# Altium schematic sheet MixerBF998.SchDoc
size A4
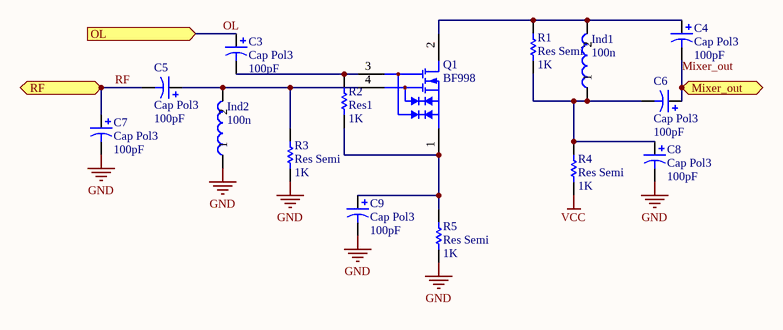
[diagram p0: MixerBF998.SchDoc]

## Parts
C3  Cap Pol3  value 100pF  [C0805]
C4  Cap Pol3  value 100pF  [C0805]
C5  Cap Pol3  value 100pF  [C0805]
C6  Cap Pol3  value 100pF  [C0805]
C7  Cap Pol3  value 100pF  [C0805]
C8  Cap Pol3  value 100pF  [C0805]
C9  Cap Pol3  value 100pF  [C0805]
Ind1  Valor: 100n  [IND_7MM]  (hidden comment: Ind2)
Ind2  Valor: 100n  [Ind_4mm]  (hidden comment: Ind2)
Q1  BF998  [SOT143_N]
R1  Res Semi  value 1K  [2012[0805]]
R2  Res1  value 1K  [AXIAL-0.3]
R3  Res Semi  value 1K  [2012[0805]]
R4  Res Semi  value 1K  [2012[0805]]
R5  Res Semi  value 1K  [2012[0805]]

## Ports
Mixer_out (out), OL (in), RF (in)

## Nets
GND: C7.2 C8.2 C9.2 Ind2.1 R3.1 R5.1
VCC: R4.1
Mixer_out: C4.2 C6.1 ; port Mixer_out
OL: C3.1 ; port OL
RF: C5.2 C7.1 ; port RF
NetC3_2: C3.2 Q1.3(G2) R2.2
NetC4_1: C4.1 Ind1.2 Q1.2(D) R1.2
NetC5_1: C5.1 Ind2.2 Q1.4(G1) R3.2
NetC6_2: C6.2 C8.1 Ind1.1 R1.1 R4.2
NetC9_1: C9.1 Q1.1(S) R2.1 R5.2

## Library data of the parts
C3-C9 = Cap Pol3: Polarized Capacitor (Surface Mount); Published: 8-Jun-2000; LatestRevisionDate: 17-Jul-2002; LatestRevisionNote: Re-released for DXP Platform.; PackageReference: C0805; Publisher: Altium Limited
Q1 = BF998: Silicon N-channel Dual-gate MOSFET; Published: 17-Sep-2003; LatestRevisionDate: 12-Dec-2006; LatestRevisionNote: IPC-7351 Footprint Added.; DatasheetVersion: Aug-1996; PackageVersion: Sep-1996; PackageReference: SOT143; Publisher: Altium Limited; PackageDescription: 4-Pin SOT-143 Package 1.9 mm Pitch, 2.3 mm Lead Span; Code_IPC: SOT143; ComponentLink1Description: Manufacturer Link; ComponentLink1URL: http://www.semiconductors.philips.com/; ComponentLink2Description: Datasheet; ComponentLink2URL: http://www.semiconductors.philips.com/acrobat/datasheets/BF998_2.pdf
R1 R3-R5 = Res Semi: Semiconductor Resistor; Published: 8-Jun-2000; LatestRevisionDate: 17-Jul-2002; LatestRevisionNote: Re-released for DXP Platform.; PackageReference: AXIAL-0.5; Publisher: Altium Limited
R2 = Res1: Resistor; Published: 8-Jun-2000; LatestRevisionDate: 17-Jul-2002; LatestRevisionNote: Re-released for DXP Platform.; PackageReference: AXIAL-0.3; Publisher: Altium Limited